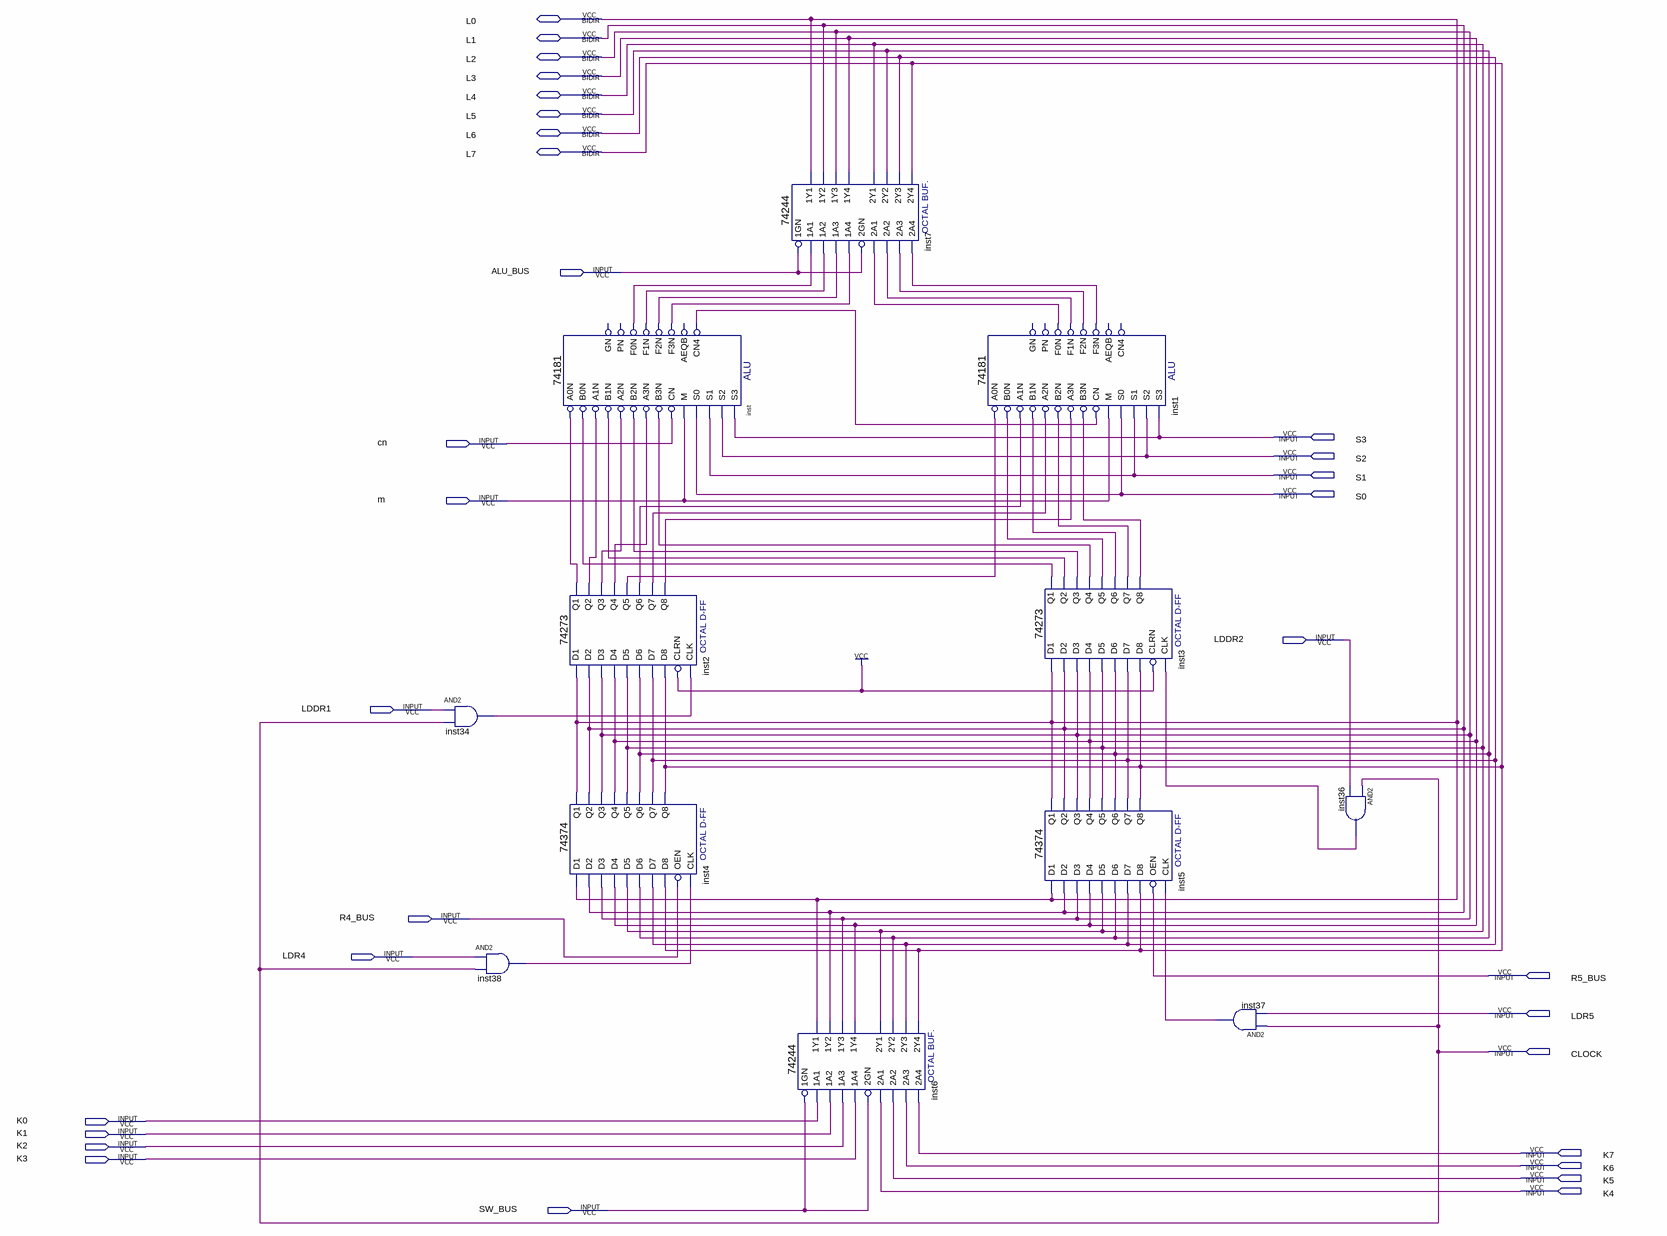
[diagram p0: schematic sheet]
// Quartus schematic alu.bdf as structural Verilog: 12 symbols, 31 pins
module alu (
  input  ALU_BUS,
  input  S3,
  input  cn,
  input  S2,
  input  S1,
  input  S0,
  input  m,
  input  LDDR2,
  input  LDDR1,
  input  R4_BUS,
  input  LDR4,
  input  R5_BUS,
  input  LDR5,
  input  CLOCK,
  input  K0,
  input  K1,
  input  K2,
  input  K7,
  input  K3,
  input  K6,
  input  K5,
  input  K4,
  input  SW_BUS,
  inout  L0,
  inout  L1,
  inout  L2,
  inout  L3,
  inout  L4,
  inout  L5,
  inout  L6,
  inout  L7
);

  wire inst1_f0n, inst1_f1n, inst1_f2n, inst1_f3n, inst2_q1, inst2_q2, inst2_q3, inst2_q4, inst2_q5,
       inst2_q6, inst2_q7, inst2_q8, inst3_q1, inst3_q2, inst3_q3, inst3_q4, inst3_q5, inst3_q6, inst3_q7,
       inst3_q8, inst34_out, inst36_out, inst37_out, inst38_out, inst_cn4, inst_f0n, inst_f1n, inst_f2n,
       inst_f3n;

  and inst34 (inst34_out, LDDR1, CLOCK);
  and inst38 (inst38_out, LDR4, CLOCK);
  \74181  inst (
    .B0N(inst3_q1), .A0N(inst2_q1), .A1N(inst2_q2), .B1N(inst3_q2), .A3N(inst2_q4), .B2N(inst3_q3),
    .A2N(inst2_q3), .M(m), .CN(cn), .B3N(inst3_q4), .S2(S2), .S1(S1), .S0(S0), .S3(S3), .F3N(inst_f3n),
    .F1N(inst_f1n), .F0N(inst_f0n), .CN4(inst_cn4), .F2N(inst_f2n));  // open: PN, GN, AEQB
  \74273  inst2 (
    .D2(L1), .D3(L2), .D1(L0), .D4(L3), .D7(L6), .D6(L5), .D5(L4), .D8(L7), .CLK(inst34_out), .CLRN(1'b1),
    .Q4(inst2_q4), .Q1(inst2_q1), .Q2(inst2_q2), .Q3(inst2_q3), .Q6(inst2_q6), .Q5(inst2_q5), .Q7(inst2_q7),
    .Q8(inst2_q8));
  \74374  inst4 (
    .D1(L0), .D2(L1), .D3(L2), .D4(L3), .D6(L5), .D5(L4), .OEN(R4_BUS), .D8(L7), .D7(L6), .CLK(inst38_out),
    .Q2(L1), .Q3(L2), .Q5(L4), .Q4(L3), .Q6(L5), .Q7(L6), .Q8(L7), .Q1(L0));
  \74244  inst7 (
    .\1A2 (inst_f1n), .\1A4 (inst_f3n), .\1A1 (inst_f0n), .\1A3 (inst_f2n), .\1GN (ALU_BUS),
    .\2A3 (inst1_f2n), .\2GN (ALU_BUS), .\2A1 (inst1_f0n), .\2A4 (inst1_f3n), .\2A2 (inst1_f1n), .\1Y2 (L1),
    .\1Y4 (L3), .\2Y1 (L4), .\1Y1 (L0), .\2Y3 (L6), .\2Y4 (L7), .\1Y3 (L2), .\2Y2 (L5));
  \74244  inst6 (
    .\1A2 (K1), .\1A4 (K3), .\1A1 (K0), .\1A3 (K2), .\1GN (SW_BUS), .\2A3 (K6), .\2GN (SW_BUS), .\2A1 (K4),
    .\2A4 (K7), .\2A2 (K5), .\1Y2 (L1), .\1Y4 (L3), .\2Y1 (L4), .\1Y1 (L0), .\2Y3 (L6), .\2Y4 (L7),
    .\1Y3 (L2), .\2Y2 (L5));
  \74181  inst1 (
    .B0N(inst3_q5), .A0N(inst2_q5), .A1N(inst2_q6), .B1N(inst3_q6), .A3N(inst2_q8), .B2N(inst3_q7),
    .A2N(inst2_q7), .M(m), .CN(inst_cn4), .B3N(inst3_q8), .S2(S2), .S1(S1), .S0(S0), .S3(S3),
    .F3N(inst1_f3n), .F1N(inst1_f1n), .F0N(inst1_f0n), .F2N(inst1_f2n));  // open: PN, GN, AEQB, CN4
  \74273  inst3 (
    .D2(L1), .D3(L2), .D1(L0), .D4(L3), .D7(L6), .D6(L5), .D5(L4), .D8(L7), .CLK(inst36_out), .CLRN(1'b1),
    .Q4(inst3_q4), .Q1(inst3_q1), .Q2(inst3_q2), .Q3(inst3_q3), .Q6(inst3_q6), .Q5(inst3_q5), .Q7(inst3_q7),
    .Q8(inst3_q8));
  \74374  inst5 (
    .D1(L0), .D2(L1), .D3(L2), .D4(L3), .D6(L5), .D5(L4), .OEN(R5_BUS), .D8(L7), .D7(L6), .CLK(inst37_out),
    .Q2(L1), .Q3(L2), .Q5(L4), .Q4(L3), .Q6(L5), .Q7(L6), .Q8(L7), .Q1(L0));
  and inst37 (inst37_out, CLOCK, LDR5);
  and inst36 (inst36_out, CLOCK, LDDR2);
endmodule
